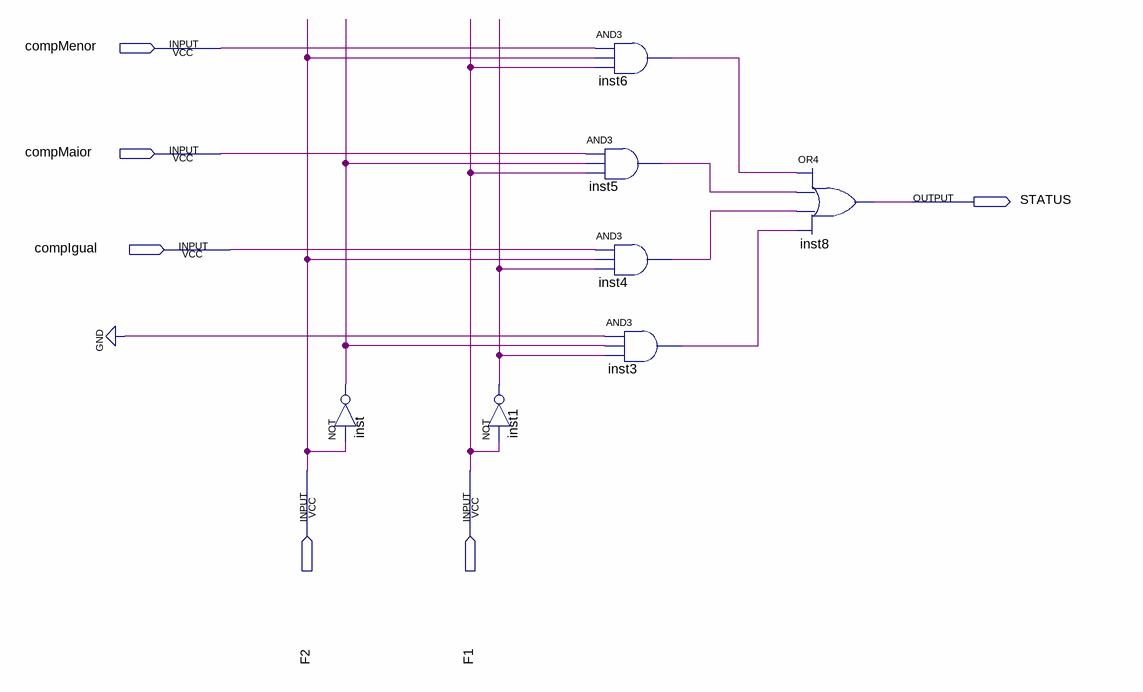
[diagram p0: schematic sheet]
// Quartus schematic mux_comparadores.bdf as structural Verilog: 7 symbols, 6 pins
module mux_comparadores (
  input  compMenor,
  input  compMaior,
  input  compIgual,
  input  F2,
  input  F1,
  output STATUS
);

  wire inst1_out, inst3_out, inst4_out, inst5_out, inst6_out, inst_out;

  not inst (inst_out, F2);
  not inst1 (inst1_out, F1);
  and inst6 (inst6_out, compMenor, F2, F1);
  and inst5 (inst5_out, compMaior, inst_out, F1);
  and inst4 (inst4_out, compIgual, F2, inst1_out);
  and inst3 (inst3_out, 1'b0, inst_out, inst1_out);
  or inst8 (STATUS, inst6_out, inst5_out, inst4_out, inst3_out);
endmodule
